# Altium schematic sheet DCMotorDriver.SchDoc: Наименование
size 420 x 297 mm; ApprovedBy: Сидоров; CheckedBy: Петров; Author: Иванов; CompanyName: РГППУ; Title2str: Изделия; DecimalNumber: АБВГ.123456.001 33
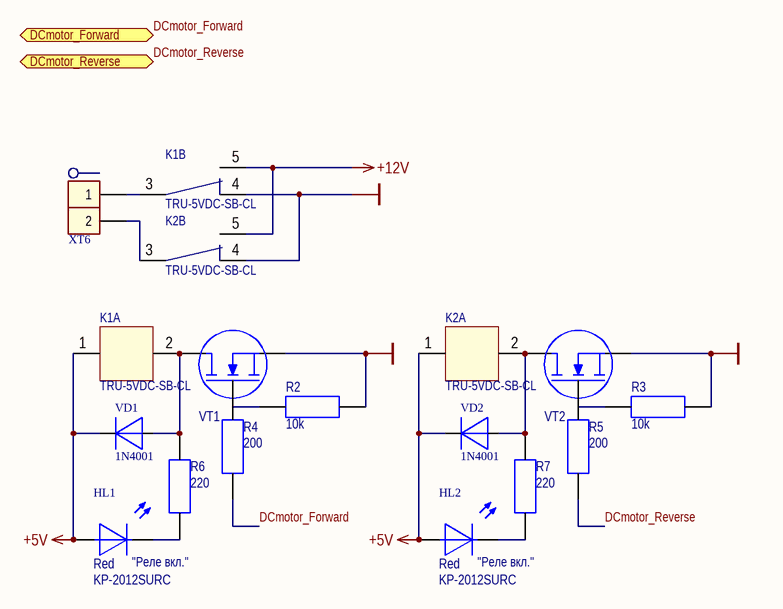
[diagram p0: DCMotorDriver.SchDoc]

## Parts
HL1  Red  ManufacturerPartNumber: KP-2012SURC  [DIOMELF2012M]
HL2  Red  ManufacturerPartNumber: KP-2012SURC  [DIOMELF2012M]
K1  TRU-5VDC-SB-CL  [TRU-5VDC-SB-CL]  (parts A,B of 2)
K2  TRU-5VDC-SB-CL  [TRU-5VDC-SB-CL]  (parts A,B of 2)
R2  10k  [SMDRC0805]
R3  10k  [SMDRC0805]
R4  200  [SMDRC0805]
R5  200  [SMDRC0805]
R6  220  [SMDRC0805]
R7  220  [SMDRC0805]
VD1  1N4001  [PinDiode]
VD2  1N4001  [PinDiode]
VT1  2N7002  [SOT23 (TO-236AB)]  (value not drawn)
VT2  2N7002  [SOT23 (TO-236AB)]  (value not drawn)
XT6  330-021-12  [330-021-12]  (value not drawn)

## Ports
DCmotor_Forward (in), DCmotor_Reverse (in)

## Nets
+5V: HL1.1 HL2.1 K1.1 K2.1 VD1.K VD2.K
+12V: K1.5 K2.5
GND: K1.4 K2.4 R2.2 R3.2 VT1.2(S) VT2.2(S)
DCmotor_Forward: R4.1 ; port DCmotor_Forward
DCmotor_Reverse: R5.1 ; port DCmotor_Reverse
NetHL1_2: HL1.2 R6.2
NetHL2_2: HL2.2 R7.2
NetK1_2: K1.2 R6.1 VD1.A VT1.3(D)
NetK1_3: K1.3 XT6.1
NetK2_2: K2.2 R7.1 VD2.A VT2.3(D)
NetK2_3: K2.3 XT6.2
NetR2_1: R2.1 VT1.1(G)
NetR3_1: R3.1 VT2.1(G)

Not connected (* = marked no-connect by the designer): R4 2; R5 2

## Notes on the sheet
- (near HL1) "Реле вкл."
- (near HL2) "Реле вкл."
- Изм.
- Лист
- N*докум.
- Подп.
- Дата
- Лит.
- Масса
- Масштаб
- Разраб.
- Пров.
- Т.контр.
- Лиcт
- Лиcтов
- Н.контр.
- Утв.

## Library data of the parts
HL1 HL2 = LED1_R: Diod LED SMD Red; ComponentLink1Description: Datasheet; Cost: 5,01; ComponentLink2Description: Datasheet-local; ComponentLink2URL: *; Color: Red
R2 R3 = Resistor 0805 10k: Generic resistor; PartNumber: Resistor 0805 10k; Value: 10k; ComponentLink1URL: http://www.mouser.com/ds/2/447/PYu-RC0402_51_RoHS_L_6_r-8721.pdf; ComponentLink1Description: Datasheet; Package: 0805
R4 R5 = Resistor 0805 200: Generic resistor; PartNumber: Resistor 0805 200; Value: 200; ComponentLink1URL: http://www.mouser.com/ds/2/447/PYu-RC0402_51_RoHS_L_6_r-8721.pdf; ComponentLink1Description: Datasheet; Package: 0805
R6 R7 = Resistor 0805 220: Generic resistor; PartNumber: Resistor 0805 220; Value: 220; ComponentLink1URL: http://www.mouser.com/ds/2/447/PYu-RC0402_51_RoHS_L_6_r-8721.pdf; ComponentLink1Description: Datasheet; Package: 0805
VD1 VD2 = 1N4001: Rectifying diode; ComponentLink1Description: Datasheet; ComponentLink1URL: http://www.promelec.ru/pdf/1N400x.pdf; Cost: 5; Package: штырьевой; ComponentLink2Description: Datasheet-local; ComponentLink2URL: *; ManufacturerPartNumber: 1N4001
VT1 VT2 = 2N7002 n-MOSFET: 60V, 300mA N-channel Trench MOSFET; ManufacturerPartNumber: 2N7002
XT6 = Con2_D 330-021-12: Demountable connection  2-pin; Manufacturer: Degson Electronics Co., Ltd; ManufacturerPartNumber: 330-021-12; ComponentLink1Description: Datasheet; Cost: 7,45; Supplier: Промэлектроника; ComponentLink2Description: Datasheet-local
K1 K2 = TRU-5VDC-SB-CL: ManufacturerPurtNumber: TRU-5VDC-SB-CL